# EasyEDA Pro project whisker-breeze.epro, board PCB1
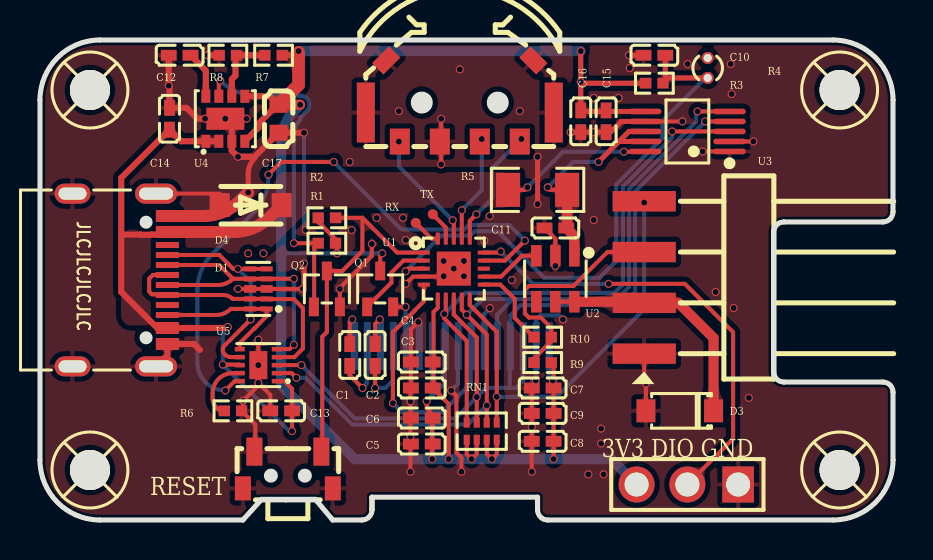
[diagram p2: board, top side]
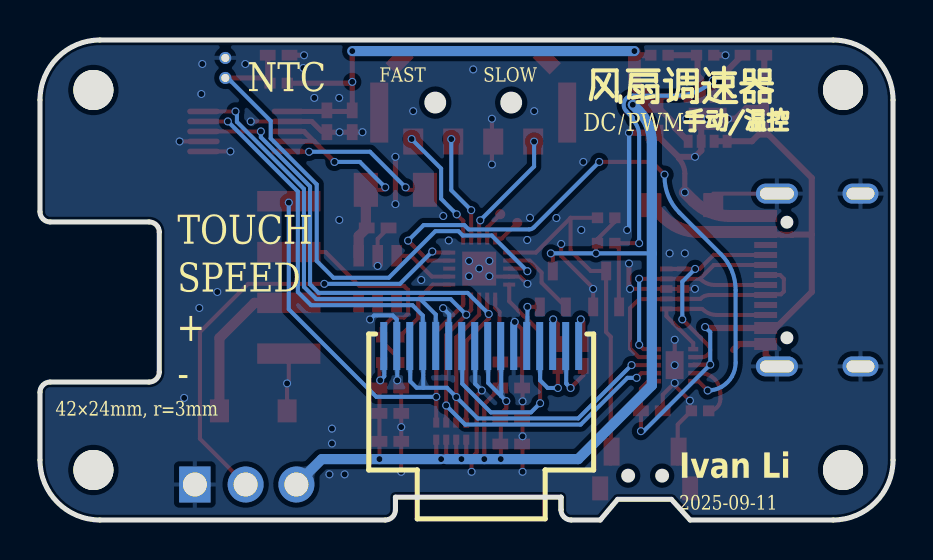
[diagram p3: board, bottom side, seen from below]

Outline 42.67 x 24 mm; copper layers: Top Layer, Bottom Layer. Coordinates in mm from the lower left corner of the outline.
Outline path: 16.61,1.14 16.61,0.51 ; 16.61,1.14 24.89,1.14 24.89,0.51 arc(25.04,0.15) 25.4,0 39.67,0 arc(41.79,0.88) 42.67,3 42.67,6.39 arc(42.52,6.75) 42.16,6.9 37.21,6.9 arc(36.85,7.05) 36.7,7.41 36.7,14.39 arc(36.85,14.75) 37.21,14.9 42.16,14.9 arc(42.52,15.05) 42.67,15.41 42.67,21 arc(41.79,23.12) 39.67,24 3,24 arc(0.88,23.12) 0,21 0,3 arc(0.88,0.88) 3,0 10.15,0 11.08,1.03 13.78,1.03 14.64,0 16.1,0 arc(16.46,0.15) 16.61,0.51 ; 16.61,1.14 16.61,0.51
Stack: Top Layer 0.035mm / Dielectric1 1.51mm FR4 er 4.5 / Bottom Layer 0.035mm

## Design rules (mm)
template: 自定义配置
spacing copperThickness1oz (default): track to track 0.102, other pairs 0.152 to 0.3
spacing copperThickness2oz: track to track 0.203, other pairs 0.152 to 0.3
track width copperThickness1oz (default): min 0.127, default 0.254, max 2.54
track width copperThickness2oz: min 0.203, default 0.254, max 2.54
differential pair differentialPair (default): width min 0.127, default 0.254, max 2.54; gap min 0.152, default 0.152
via viaSize (default): diameter min 0.4, default 0.4, max 10; hole min 0.3, default 0.3, max 6.3

## Placement (name value [footprint] x y rotation side)
C1  1uF  [C0402]  15.49 8.25 90 top
C2  1uF  [C0402]  16.76 8.25 90 top
C3  1uF  [C0402]  19.1 6.6 0 top
C4  100nF  [C0402]  19.1 7.9 0 top
C5  4.7uF  [C0402]  19.1 3.8 0 top
C6  100nF  [C0402]  19.1 5.1 0 top
C7  2.2uF  [C0402]  25.15 6.6 180 top
C8  4.7uF  [C0402]  25.15 3.93 180 top
C9  100nF  [C0402]  25.15 5.33 180 top
C10  100nF  [C0402]  30.73 23.24 0 top
C11  1uF  [C0402]  25.78 14.6 0 top
C12  330pF  [C0402]  6.99 23.24 0 top
C13  1uF  [C0402]  12.06 5.46 0 top
C14  10uF  [C0402]  6.48 20.06 270 top
C15  100nF  [C0402]  28.32 19.94 90 top
C16  1uF  [C0402]  27.05 19.94 90 top
C17  22uF  [C0603]  11.94 20.06 270 top
D1  TPD4E05U06DQAR  [USON-10_L2.5-W1.0-P0.50-BL]  10.92 11.55 90 top
D3  DSK34  [SOD-123_L2.8-W1.8-LS3.7-RD]  32 5.46 180 top
D4  SMF12A  [SOD-123F_L2.8-W1.8-LS3.7-RD]  10.54 15.75 180 top
H1  2.54_1x3  [HDR-TH_3P-P2.54-V-M-1]  32.38 1.78 180 top
H2  KH-2.54PH-1X4P-L13.5-WT  [HDR-SMD_4P-P2.54-H-M-W13.3-N]  30.23 12.13 90 top
OLED1  N042-7240TSWPG01-H16  [OLED-SMD_L23.0-W12.0_N042-7240TSWPG01-H16]  20.6 8.7 0 bottom
Q1  BSS84AKW,115  [SOT-323-3_L2.0-W1.3-P1.30-LS2.1-BR]  17.02 11.55 270 top
Q2  NX7002BKWX  [SOT-323-3_L2.0-W1.3-P1.30-LS2.1-BR]  14.35 11.55 270 top
R1  100kΩ  [R0402]  14.35 13.84 0 top
R2  100kΩ  [R0402]  14.35 15.11 180 top
R3  8.2kΩ  [R0402]  30.73 21.84 180 top
R4  MF51B 103F3950  [RES-TH_BD1.5-P1.00-D0.2]  33.4 22.6 270 top
R5  10mΩ  [R1206]  24.89 16.51 0 top
R6  24kΩ  [R0402]  9.65 5.46 0 top
R7  31.6kΩ  [R0402]  11.68 23.24 0 top
R8  10kΩ  [R0402]  9.4 23.24 0 top
R9  10kΩ  [R0402]  25.15 7.87 0 top
R10  100Ω  [R0402]  25.15 9.14 0 top
RN1  4.7kΩ  [RES-ARRAY-SMD_0402-8P-L2.0-W1.0-BL]  22.1 4.44 180 top
RX  -  [Test-Point-0.5mm]  18.8 14.86 0 top
SCREW1  -  [M2螺丝]  2.5 21.5 0 top
SCREW2  -  [M2螺丝]  40 21.5 0 top
SCREW3  -  [M2螺丝]  2.5 2.5 0 top
SCREW4  -  [M2螺丝]  40 2.5 0 top
SW1  TM-2024A  [SW-SMD_TM-2024A]  21 20.95 0 top
SW2  TS24CA 250gf 013  [SW-SMD_L4.7-W3.5-P3.35-EH]  12.4 2.5 180 top
TX  -  [Test-Point-0.5mm]  19.65 15.29 0 top
U1  CH32V003F4U6  [QFN-20_L3.0-W3.0-P0.40-TL-EP1.7]  20.7 12.57 0 top
U2  TPS22810DBVR  [SOT-23-6_L2.9-W1.6-P0.95-LS2.8-BL]  25.78 12.06 180 top
U3  INA226AIDGSR  [MSOP-10_L3.0-W3.0-P0.50-LS5.0-BL]  32.38 19.43 90 top
U4  TPS82130SILR  [USIP-8_L3.0-W2.8-P0.65-TL-EP]  9.27 20.06 90 top
U5  CH224Q  [DFN-10_L2.0-W2.0-P0.40-BL-EP]  10.92 7.74 90 top
USB1  TYPEC-304A-ACP16O  [USB-SMD_TYPEC-304A-ACP16O]  4 12 270 top

## Footprints (pads in the part's own frame, mm; a bottom-side part is the same pattern mirrored in y, then rotated)
C0402
  rect 0.79x0.54 smd: 1(-0.545,0) 2(0.545,0)
C0603
  rect 0.8x0.9 smd: 1(-0.7,0) 2(0.7,0)
DFN-10_L2.0-W2.0-P0.40-BL-EP
  rect 0.224x0.505 smd: 1(-0.8,-0.927) 2(-0.4,-0.927) 3(0,-0.927) 4(0.4,-0.927) 5(0.8,-0.927) 6(0.8,0.927) 7(0.4,0.927) 8(0,0.927) 9(-0.4,0.927) 10(-0.8,0.927)
  rect 1.4x0.9 smd: 11(0,0)
HDR-SMD_4P-P2.54-H-M-W13.3-N
  rect 1.02x3.16 smd: 1(-3.81,0) 2(-1.27,0) 3(1.27,0) 4(3.81,0)
HDR-TH_3P-P2.54-V-M-1
  rect 1.575x1.8 hole 1.2: 1(-2.54,0)
  round 1.8 hole 1.2: 2(0,0) 3(2.54,0)
M2螺丝
  round 2 hole 2: 1(0,0)
MSOP-10_L3.0-W3.0-P0.50-LS5.0-BL
  oval 0.28x1.62 smd: 1(-1,-2.11) 2(-0.5,-2.11) 3(0,-2.11) 4(0.5,-2.11) 5(1,-2.11) 6(1,2.11) 7(0.5,2.11) 8(0,2.11) 9(-0.5,2.11) 10(-1,2.11)
OLED-SMD_L23.0-W12.0_N042-7240TSWPG01-H16
  rect 0.35x2.4 smd: 1(-4.875,0) 2(-4.225,0) 3(-3.575,0) 4(-2.925,0) 5(-2.275,0) 6(-1.625,0) 7(-0.975,0) 8(-0.325,0) 9(0.325,0) 10(0.975,0) 11(1.625,0) 12(2.275,0) 13(2.925,0) 14(3.575,0) 15(4.225,0) 16(4.875,0)
QFN-20_L3.0-W3.0-P0.40-TL-EP1.7
  rect 0.6x0.2 smd: 1(-1.5,0.8) 2(-1.5,0.401) 3(-1.5,0) 4(-1.5,-0.4) 5(-1.5,-0.8) 11(1.5,-0.8) 12(1.5,-0.4) 13(1.5,0) 14(1.5,0.401) 15(1.5,0.8)
  rect 0.2x0.6 smd: 6(-0.8,-1.5) 7(-0.4,-1.5) 8(0,-1.5) 9(0.4,-1.5) 10(0.799,-1.5) 16(0.8,1.5) 17(0.4,1.5) 18(0,1.5) 19(-0.4,1.5) 20(-0.8,1.5)
  rect 1.7x1.7 smd: 21(0,0)
R0402
  rect 0.566x0.54 smd: 1(-0.433,0) 2(0.433,0)
R1206
  rect 1.208x1.701 smd: 1(-1.479,0) 2(1.479,0)
RES-ARRAY-SMD_0402-8P-L2.0-W1.0-BL
  rect 0.3x0.505 smd: 1(-0.75,0.427) 2(-0.25,0.427) 3(0.25,0.427) 4(0.75,0.427) 5(0.75,-0.427) 6(0.25,-0.427) 7(-0.25,-0.427) 8(-0.75,-0.427)
RES-TH_BD1.5-P1.00-D0.2
  round 0.6 hole 0.4: 1(-0.5,0) 2(0.5,0)
SOD-123_L2.8-W1.8-LS3.7-RD
  rect 0.95x1.15 smd: 1(-1.692,0) 2(1.692,0)
SOD-123F_L2.8-W1.8-LS3.7-RD
  rect 1x1.2 smd: 1(-1.55,0) 2(1.55,0)
SOT-23-6_L2.9-W1.6-P0.95-LS2.8-BL
  rect 0.532x1.072 smd: 1(-0.95,-1.149) 2(0,-1.149) 3(0.95,-1.149) 4(0.95,1.149) 5(0,1.149) 6(-0.95,1.149)
SOT-323-3_L2.0-W1.3-P1.30-LS2.1-BR
  rect 0.936x0.5 smd: 1(0.898,-0.65) 2(0.898,0.65) 3(-0.898,0)
SW-SMD_L4.7-W3.5-P3.35-EH
  rect 0.8x1.4 smd: 1(-1.675,-0.917) 2(1.675,-0.917)
  rect 0.8x1.2 smd: 3(-2.25,0.917) 4(2.25,0.917)
SW-SMD_TM-2024A
  rect 1x1.3 smd: 1(-3,-2.03) 2(3,-2.03) 3(-1,-2.03) 4(1,-2.03)
  rect 0.9x3 smd: 5(-4.7,-0.58) 6(4.7,-0.58)
  rect 1.2x0.8 smd rot 45: 7(-3.68,2.03)
  rect 1.2x0.8 smd rot 135: 8(3.68,2.03)
Test-Point-0.5mm
  round 0.5 smd: 1(0,0)
USB-SMD_TYPEC-304A-ACP16O
  oval 1x2.1 hole 0.6x1.7: 12(-4.32,1.808) 13(4.32,1.808)
  oval 1x1.8 hole 0.6x1.4: 14(-4.32,-2.373) 15(4.32,-2.373)
  rect 0.6x1.15 smd: A1B12(-3.2,2.373) A4B9(-2.4,2.373) B1A12(3.2,2.373) B4A9(2.4,2.373)
  rect 0.3x1.15 smd: A5(-1.25,2.373) A6(-0.25,2.373) A7(0.25,2.373) A8(1.25,2.373) B5(1.75,2.373) B6(0.75,2.373) B7(-0.75,2.373) B8(-1.75,2.373)
USIP-8_L3.0-W2.8-P0.65-TL-EP
  rect 0.65x0.45 smd: 1(-1.125,0.975) 2(-1.125,0.325) 3(-1.125,-0.325) 4(-1.125,-0.975) 5(1.125,-0.975) 6(1.125,-0.325) 7(1.125,0.325) 8(1.125,0.975)
  rect 1.1x1.9 smd: 9(0,0)
USON-10_L2.5-W1.0-P0.50-BL
  rect 0.25x0.609 smd: 1(-1,-0.414) 2(-0.5,-0.414) 4(0.5,-0.414) 5(1,-0.414) 6(1,0.414) 7(0.5,0.414) 9(-0.5,0.414) 10(-1,0.414)
  rect 0.38x0.609 smd: 3(0,-0.414) 8(0,0.414)

## Nets
As in the schematic.

Pads without a net: SCREW1 1; SCREW2 1; SCREW3 1; SCREW4 1; U1 13; U2 4; USB1 A8 B8

## Via types
v1: diameter 0.4, hole 0.3, Top Layer to Bottom Layer, 130 vias

## Routing (per net, layer and track width the routed paths; a pad name or vN(x,y) marks a point on that pad's centre or on a via; arc(x,y) is an arc through that point)
3V3: length 102.3
  Top Layer w0.203: U1.6 19.9,10.62 19.69,10.4 19.69,7.96 ; 25.58,7.87 25.69,7.76 v1(25.69,3.05) ; RN1.2 22.35,4.01 22.35,3.3 v1(22.61,3.05) 22.85,3.29 RN1.1 ; v1(19.34,5.94) 19.34,5.58 19.52,5.41 arc(19.61,5.27) C6.2 ; 19.62,4.98 v1(19.62,3.05) ; Q1.3 17.02,13.23 v1(17.12,13.33) ; C3.2 20.45,5.8 v1(20.45,3.05) ; 14.78,14.04 14.86,13.97 v1(14.86,13.33) ; 14.78,14.04 13.92,14.91 R2.2 ; 14.78,14.04 R1.2 ; 19.69,7.96 19.69,6.64 ; 19.69,7.96 19.59,7.87 ; RN1.3 21.85,3.3 v1(21.59,3.05) 21.35,3.29 RN1.4
  Top Layer w0.254: v1(27.05,21.91) v1(27.05,23.45) ; v1(27.05,21.91) 27.12,21.84 30.3,21.84 ; v1(27.05,21.91) 27.05,20.61 27.23,20.43 ; 27.05,20.48 27.1,20.43 27.23,20.43 ; 27.23,20.43 30.28,20.43
  Top Layer w0.305: 11.88,20.76 10.92,19.81 10.92,19.61 U4.4 ; R7.2 12.73,23.24 v1(12.94,23.45) ; U4.5 11.51,21.19 C17.1
  Top Layer w0.508: 13.02,20.76 C17.1
  Top Layer w0.635: C17.1 12.94,21.76 12.94,23.38
  Bottom Layer w0.203: 12.06,13.33 12.07,13.33 v1(14.86,13.33) v1(17.12,13.33) ; 19.6,6.2 20.25,6.85 20.25,8.38 ; 19.6,6.2 19.6,8.25 ; 19.6,6.2 v1(19.34,5.94) ; v1(25.65,6.98) 25.45,7.19 25.45,8.38
  Bottom Layer w0.508: v1(22.61,3.05) v1(25.69,3.05) 28.57,3.05 H1.3 ; 22.35,3.05 v1(21.59,3.05) v1(20.45,3.05) v1(19.62,3.05) 15.75,3.05 12.06,6.73 12.06,18.89 arc(12.23,19.74) 12.72,20.46 v1(13.02,20.76) ; v1(27.05,23.45) v1(12.94,23.45)
GND: length 95.6
  Top Layer w0.203: v1(10.92,6.86) v1(10.92,7.74) v1(10.92,9.01) ; v1(10.92,6.86) 11.52,6.26 C13.1 ; v1(10.92,6.86) 10.92,6.73 v1(10.16,5.97) 10.16,5.53 R6.2 10.77,4.77 10.77,2.82 ; v1(20.07,17.78) v1(20.07,20.06) ; v1(24.6,2.41) C8.2 v1(24.6,4.65) C9.2 C7.2 ; C11.1 25.78,14.06 v1(25.78,12.7) ; U3.2 v1(35.69,18.93) ; H2.1 30.23,6.91 v1(30.31,6.83) D3.2 ; C3.1 C4.1 18.56,9.53 v1(18.92,9.9) ; U3.1 v1(33.15,18.43) ; v1(20.57,6.48) 20.83,6.22 20.83,3.38 21.08,3.12 v1(21.08,2.41) ; 9.91,11.55 D1.8 D1.3 13.08,11.55 ; v1(16.6,13.8) 16.6,13.2 15,11.6 v1(15,11.55) Q2.2 ; 18.53,6.57 v1(18.53,5.93) v1(18.53,4.19) v1(18.53,2.41) ; 30.28,19.93 v1(32.13,19.93) ; USB1.12 8.99,16.32 ; v1(20.19,12.19) 20.17,12.17 U1.4 18.66,12.17 18.48,11.99 18.47,11.99 v1(18.29,11.81) ; 10.73,18.08 10.73,18.16
  Top Layer w0.254: 30.19,23.24 v1(29.46,23.24) ; v1(13.21,12.82) 13.21,11.61 v1(13.15,11.55) ; C15.1 v1(27.69,19.39) C16.1 v1(26.54,19.39) ; v1(10.41,16.38) 10.41,17.31 arc(10.5,17.72) 10.73,18.08 ; 28.57,19.43 29.07,19.93 30.28,19.93 ; v1(24.89,15.79) v1(24.89,18.16)
  Top Layer w0.305: USB1.13 6.37,8.25 USB1.B1A12 7.71,8.8 8,8.51 ; 9.63,20.06 9.6,20.03 U4.3 9.59,18.93 9.59,18.48 v1(9.91,18.16) 10.73,18.16 C17.2 v1(13.21,19.36) ; 9.63,20.06 v1(9.27,20.06) v1(8.25,20.06) 7.87,20.06 7.33,20.61 C14.1 6.48,21.68 v1(6.44,21.71) C12.1 ; 9.63,20.06 v1(10.34,20.06) ; R8.1 v1(8.38,23.24)
  Top Layer w0.6: v1(10.41,16.38) 9.98,15.94 arc(9.15,15.39) 8.18,15.2 USB1.A1B12
  Bottom Layer w0.203: v1(24.8,6.98) 24.8,9.68 24.82,9.71 ; 20.9,8.38 20.9,6.81 v1(20.57,6.48) ; v1(18.92,9.9) 18.92,8.28 18.95,8.25 ; v1(13.3,14.5) 13.21,14.59 v1(13.21,19.36) ; v1(22.51,10.59) 22.2,10.29 22.2,8.38 ; 24.82,9.71 24.82,10.03 25.03,10.23 25.96,10.23 v1(26.16,10.03) ; 24.82,9.71 OLED1.15
  vias: v1(9.91,11.56) v1(10.41,13.33) v1(11.18,13.33) v1(15.49,17.9) v1(15.59,14.5) v1(16.84,15.1) v1(17.95,20.44) v1(18.16,15.11) v1(18.3,14) v1(20.19,12.95) v1(20.7,12.57) v1(21,22.53) v1(21.21,12.95) v1(21.21,12.19) v1(22.22,13.98) v1(22.5,15.2) v1(23.6,12) v1(24,20.44) v1(27.43,2.28) v1(27.71,21.1) v1(27.7,15) v1(28.07,4.57) v1(28.07,3.83) v1(28.19,2.28) v1(28.95,21.1) v1(29.5,22.6) v1(32.4,22.8) v1(33.8,11.4) v1(34.55,22.8) v1(34.6,21.3) v1(34.7,10.6) v1(35.46,6.11)
VBUS: length 44.9
  Top Layer w0.203: v1(9.14,7.77) 9.97,7.77 U5.8 ; v1(12.61,4.44) C13.2 12.61,6.56 12.23,6.94 U5.1 ; R5.1 24.26,16.51 v1(24.38,16.63) ; 30.28,18.43 30.26,18.41 v1(29.21,18.41)
  Top Layer w0.305: 4.06,14.27 4.06,11.4 5.87,9.6 USB1.B4A9 9.35,9.6 v1(9.4,9.65) ; 4.06,14.27 5.04,14.27 5.05,14.26 5.57,14.26 5.58,14.27 6.24,14.27 USB1.A4B9 ; 4.06,14.27 4.06,17.11 C14.2 7.06,18.94 U4.1 U4.2
  Top Layer w0.6: USB1.A4B9 9.69,14.4 arc(9.7,14.4) 9.7,14.4 arc(10.67,14.6) 11.49,15.14 D4.1
  Bottom Layer w0.203: v1(24.38,16.63) 26.16,18.41 v1(29.21,18.41) ; v1(12.61,4.44) 12.47,4.44 v1(9.14,7.77) 9.14,9.39 v1(9.4,9.65)
VBUS_PG: length 31.1
  Top Layer w0.203: v1(11.43,17.27) 12.06,17.9 v1(14.7,17.9) ; U5.10 9.74,6.94 v1(9.27,6.47) ; v1(24.26,13.97) 23.26,12.97 U1.14
  Bottom Layer w0.203: v1(24.26,13.97) 23.48,14.75 21.45,14.75 21.23,14.53 18.2,14.53 arc(18.08,14.55) 17.98,14.62 v1(14.7,17.9) ; v1(11.43,17.27) 11.43,17.16 arc(11.24,16.19) 10.69,15.37 8.62,13.3 arc(8.07,12.48) 7.87,11.5 7.87,7.87 arc(7.92,7.51) 8.06,7.18 arc(8.28,6.88) 8.58,6.66 arc(8.91,6.52) v1(9.27,6.47)
BAT: length 4.1
  Top Layer w0.203: U1.2 18.18,12.97 17.58,12.37 17.58,11.87 Q1.1
CC1: length 11.2
  Top Layer w0.203: D1.5 D1.6 v1(9.9,12.55) 9.67,12.55 8.96,13.26 8.95,13.25 USB1.A5 ; U5.7 9.56,8.14 arc(9.39,8.18) 9.25,8.27 arc(9.17,8.38) 9.14,8.51 arc(9.17,8.62) 9.23,8.72 v1(10.54,10.03)
  Bottom Layer w0.203: v1(9.9,12.55) 10.54,11.91 v1(10.54,10.03)
CC2: length 7.6
  Top Layer w0.203: U5.6 9.99,8.85 10.72,9.58 10.73,9.58 10.99,9.84 10.99,9.85 11.34,10.19 D1.1 D1.10 9.54,10.55 arc(9.2,10.33) 8.81,10.25 USB1.B5
DM: length 14.2
  Top Layer w0.203: USB1.A7 8.9,11.75 arc(9.31,11.83) 9.65,12.06 ; 9.65,12.06 v1(12.7,12.06) ; 9.65,12.06 8.96,12.75 USB1.B7 ; v1(12.7,8.76) 12.48,8.54 U5.5
  Bottom Layer w0.203: v1(12.7,12.06) v1(12.7,8.76)
DP: length 13.1
  Top Layer w0.203: U5.4 12.73,8.14 13.15,8.57 13.15,10.59 12.7,11.05 11.34,11.05 D1.2 D1.9 9.64,11.05 arc(9.43,11.2) 9.17,11.25 USB1.B6 6.34,11.28 5.6,11.28 5.46,11.43 5.46,12.06 5.65,12.25 USB1.A6
FAN_EN: length 3.1
  Top Layer w0.203: U2.3 24.11,13.21 23.07,12.17 U1.12
FAN_PWM: length 21.3
  Top Layer w0.203: RN1.8 v1(22.85,6.16) 22.85,9.41 21.5,10.75 U1.10
  Bottom Layer w0.203: v1(30.23,15.87) 30.23,10.54 25.85,6.16 v1(22.85,6.16)
FAN_TOUCH: length 4.2
  Top Layer w0.203: R10.1 23.75,10.11 23.75,11.05 23.03,11.77 U1.11
FAST: length 6
  Top Layer w0.203: v1(21.83,15.28) 21.5,14.96 U1.16
  Bottom Layer w0.203: v1(21.83,15.28) 22.61,16.06 22.61,17.57 v1(24.08,19.05)
INT: length 27.8
  Top Layer w0.203: U1.7 20.3,10.38 v1(20.22,10.3) 20.22,10.08 21.35,8.95 RN1.5 ; v1(31.62,19.43) U3.3
  Bottom Layer w0.203: v1(31.62,19.43) 31.62,19.14 29.16,16.68 29.16,11.79 28.73,11.35 21.28,11.35 v1(20.22,10.3)
MODE: length 5.4
  Top Layer w0.203: U1.17 v1(21.1,15.49)
  Bottom Layer w0.203: v1(22.1,19.05) 22.1,16.49 v1(21.1,15.49)
NRST: length 18.7
  Top Layer w0.203: 16.13,15.11 R2.1 ; 16.13,15.11 17.87,13.37 U1.1 ; 16.13,15.11 16.13,13.46 15.12,12.45 Q2.3 14.35,9.39 14.12,9.17 14.12,2.82
PD1: length 22.7
  Top Layer w0.203: v1(28.45,11.81) 32.26,11.81 34.67,9.39 34.67,4.06 H1.2 ; U1.15 22.99,13.37 v1(23.05,13.42)
  Bottom Layer w0.203: v1(28.45,11.81) 24.66,11.81 v1(23.05,13.42)
PG: length 17.4
  Top Layer w0.203: Q2.1 13.72,10.67 13.72,13.64 R1.1 v1(12.7,13.84) ; U4.7 8.95,21.9 v1(9.02,21.97)
  Bottom Layer w0.203: v1(12.7,13.84) 12.7,19.24 arc(12.78,19.65) 13.02,20 13.02,20.11 arc(13.03,20.12) 13.04,20.14 13.34,20.44 arc(13.44,20.94) 13.02,21.22 10.82,21.22 arc(10.44,21.25) 10.07,21.33 arc(9.51,21.58) 9.02,21.96 v1(9.02,21.97)
RES: length 12.7
  Top Layer w0.203: v1(17.65,5.84) 17.65,9.39 18.47,10.2 18.48,10.2 18.74,10.47 18.74,10.48 19.2,10.94 U1.5
  Bottom Layer w0.203: v1(17.65,5.84) 18.11,5.38 20.12,5.38 21.55,6.81 21.55,8.25
SCL: length 42.3
  Top Layer w0.203: v1(12.83,7.11) 12.59,7.34 U5.2 ; U3.5 v1(32.89,20.43) ; U1.9 21.1,10.51 v1(21.35,10.27) 22.35,9.26 v1(22.35,5.72) 22.35,4.87 RN1.7
  Bottom Layer w0.203: 23.65,11.05 22.88,10.28 OLED1.12 ; 23.65,11.05 22.13,11.05 v1(21.35,10.27) ; 23.65,11.05 28.85,11.05 29.47,11.66 29.47,16.55 32.82,19.91 32.82,20.36 v1(32.89,20.43) ; 22.85,8.25 22.85,8.7 ; v1(12.83,7.11) 13.28,7.11 15.62,4.77 21.4,4.77 v1(22.35,5.72)
SDA: length 44.7
  Top Layer w0.203: v1(13.08,7.74) U5.3 ; RN1.6 v1(21.85,6.15) 21.85,9.12 20.7,10.27 U1.8 ; U3.4 v1(33.27,19.93)
  Bottom Layer w0.203: v1(13.08,7.74) 15.75,5.08 20.78,5.08 v1(21.85,6.15) 22.31,6.61 23.5,6.61 ; v1(33.27,19.93) 29.77,16.43 29.77,11.41 29.11,10.74 24.04,10.74 23.53,10.22 23.53,9.68 ; 23.53,9.68 23.5,9.65 23.5,6.61 ; 23.53,9.68 OLED1.13 ; 24.15,8.25 24.15,6.93 23.83,6.61 23.5,6.61
SLOW: length 6
  Top Layer w0.203: v1(20.65,14.98) 20.7,14.93 U1.18
  Bottom Layer w0.203: v1(17.96,18.92) 17.96,17.68 v1(20.65,14.98)
TS: length 28.4
  Top Layer w0.203: v1(18.29,12.44) 18.42,12.57 U1.3
  Top Layer w0.254: 31.28,21.95 31.43,22.1 R4.2 ; 31.28,21.95 C10.2 ; 31.28,21.95 R3.1
  Bottom Layer w0.203: R4.2 33.28,22.1 31.13,19.95 31.13,19.08 28.83,16.78 28.83,12.95 27.99,12.11 25.22,12.11 22.89,14.44 21.74,14.44 21.52,14.22 20.08,14.22 v1(18.29,12.44)
VFAN: length 12.3
  Top Layer w0.203: U2.5 U2.6 ; 33.7,5.96 D3.1
  Top Layer w0.508: U2.6 30.17,10.91 H2.2 31.94,10.86 33.7,9.1 33.7,5.96
$1N759: length 3.6
  Top Layer w0.203: C2.1 v1(16.76,6.6)
  Bottom Layer w0.203: 17.65,8.38 17.65,8.38 17.65,6.98 17.27,6.6 v1(16.76,6.6)
$1N760: length 3
  Top Layer w0.203: Q1.2 v1(18.29,10.66)
  Bottom Layer w0.203: v1(18.29,10.66) 18.29,8.26 18.3,8.25
$1N763: length 3
  Top Layer w0.203: v1(17,10.03) 16.76,9.8 C2.2
  Bottom Layer w0.203: 17,8.38 v1(17,10.03)
$1N764: length 3.2
  Top Layer w0.203: C1.1 15.49,7.24 v1(16.13,6.6)
  Bottom Layer w0.203: v1(16.13,6.6) 16.31,6.78 16.31,6.79 16.35,6.83 16.35,8.38
$1N776: length 3
  Top Layer w0.203: C1.2 15.49,9.9 v1(15.62,10.03)
  Bottom Layer w0.203: v1(15.62,10.03) 15.7,9.95 15.7,8.38
$1N1343: length 1.4
  Top Layer w0.203: U1.20 19.58,14.07 RX.1
$1N1345: length 1.6
  Top Layer w0.203: 19.56,15.36 20.3,14.62 U1.19
$1N2199: length 11.8
  Top Layer w0.203: R5.2 25.53,16.51 v1(25.4,16.63)
  Top Layer w0.254: 28.96,18.93 30.28,18.93 ; 28.96,18.93 v1(27.94,17.9) ; 28.96,18.93 29.46,19.43 30.28,19.43
  Top Layer w0.508: U2.1 26.73,14.2 C11.2 26.37,14.65 R5.2
  Bottom Layer w0.203: v1(25.4,16.63) 26.67,17.9 v1(27.94,17.9)
$1N3256: length 11.6
  Top Layer w0.203: H2.3 28.39,13.4 26.69,11.7 24.46,11.7 24.26,11.5 24.26,10.33 24.46,10.12 25.05,10.12 25.58,9.6 25.58,8.94 24.71,8.07 R9.1
$1N3616: length 3.6
  Top Layer w0.305: R7.1 R8.2 9.78,23.19 9.78,22.22 9.6,22.04 U4.6
$1N3620: length 2.4
  Top Layer w0.305: U4.8 8.3,22.47 C12.2
$1N3914: length 3.1
  Top Layer w0.203: U5.9 9.64,7.34 arc(9.63,7.34) 9.61,7.34 arc(9.47,7.33) 9.33,7.3 arc(8.83,6.93) 8.64,6.34 8.64,6.04 arc(8.81,5.63) R6.1

## Copper pours and planes (outline as drawn; the poured copper is in the pictures)
GND on Top Layer: -0.5,28 42.5,28 42.5,-2 -0.5,-2
GND on Bottom Layer: -2,27 45.5,27 45.5,-3 -2,-3
VBUS on Top Layer: 4.57,9.73 4.46,9.74 4.32,9.79 4.21,9.88 4.12,9.99 4.07,10.13 4.06,10.24 4.06,14.01 4.07,14.12 4.12,14.26 4.21,14.37 4.32,14.46 4.46,14.51 4.57,14.52 5.34,14.52 5.45,14.51 5.58,14.46 5.7,14.37 5.78,14.26 5.84,14.12 5.85,14.01 5.85,10.24 5.84,10.13 5.78,9.99 5.7,9.88 5.58,9.79 5.45,9.74 5.34,9.73
VBUS on Top Layer: 13.44,16.2 13.51,16.12 13.57,15.99 13.59,15.85 13.57,15.7 13.51,15.57 13.44,15.49 11.65,13.69 11.57,13.62 11.43,13.56 11.29,13.54 11.15,13.56 11.02,13.62 10.93,13.69 10.13,14.49 10.06,14.58 10,14.71 9.98,14.85 10,14.99 10.06,15.13 10.13,15.21 11.93,17 12.01,17.07 12.14,17.13 12.29,17.15 12.43,17.13 12.56,17.07 12.64,17
VBUS on Top Layer: 7.27,14.61 7.28,14.71 7.33,14.85 7.42,14.97 7.54,15.05 7.67,15.1 7.78,15.11 11.05,15.11 11.16,15.1 11.29,15.05 11.41,14.97 11.49,14.85 11.54,14.71 11.56,14.61 11.56,13.83 11.54,13.73 11.49,13.59 11.41,13.48 11.29,13.39 11.16,13.34 11.05,13.33 7.78,13.33 7.67,13.34 7.54,13.39 7.42,13.48 7.33,13.59 7.28,13.73 7.27,13.83
VBUS on Top Layer: 11.72,16.89 11.73,17 11.78,17.13 11.87,17.25 11.98,17.33 12.12,17.38 12.23,17.4 23.11,17.4 23.22,17.38 23.36,17.33 23.47,17.25 23.56,17.13 23.61,17 23.62,16.89 23.62,16.12 23.61,16.01 23.56,15.87 23.47,15.76 23.36,15.67 23.22,15.62 23.11,15.61 12.23,15.61 12.12,15.62 11.98,15.67 11.87,15.76 11.78,15.87 11.73,16.01 11.72,16.12

Small or netless copper shapes (teardrops, artwork), in the pictures only: 215 on Top Layer, 62 on Bottom Layer

## Text on the board
Bottom Silkscreen Layer: 2025-09-11 | 42×24mm, r=3mm | 手动/温控 | DC/PWM | NTC | TOUCH / SPEED / + / - | Ivan Li | SLOW | FAST | 风扇调速器
Top Silkscreen Layer: JLCJLCJLCJLC | RESET | 3V3 DIO GND
